# EAGLE design fabo-atmega-dev-au (EAGLE 7.7.0)
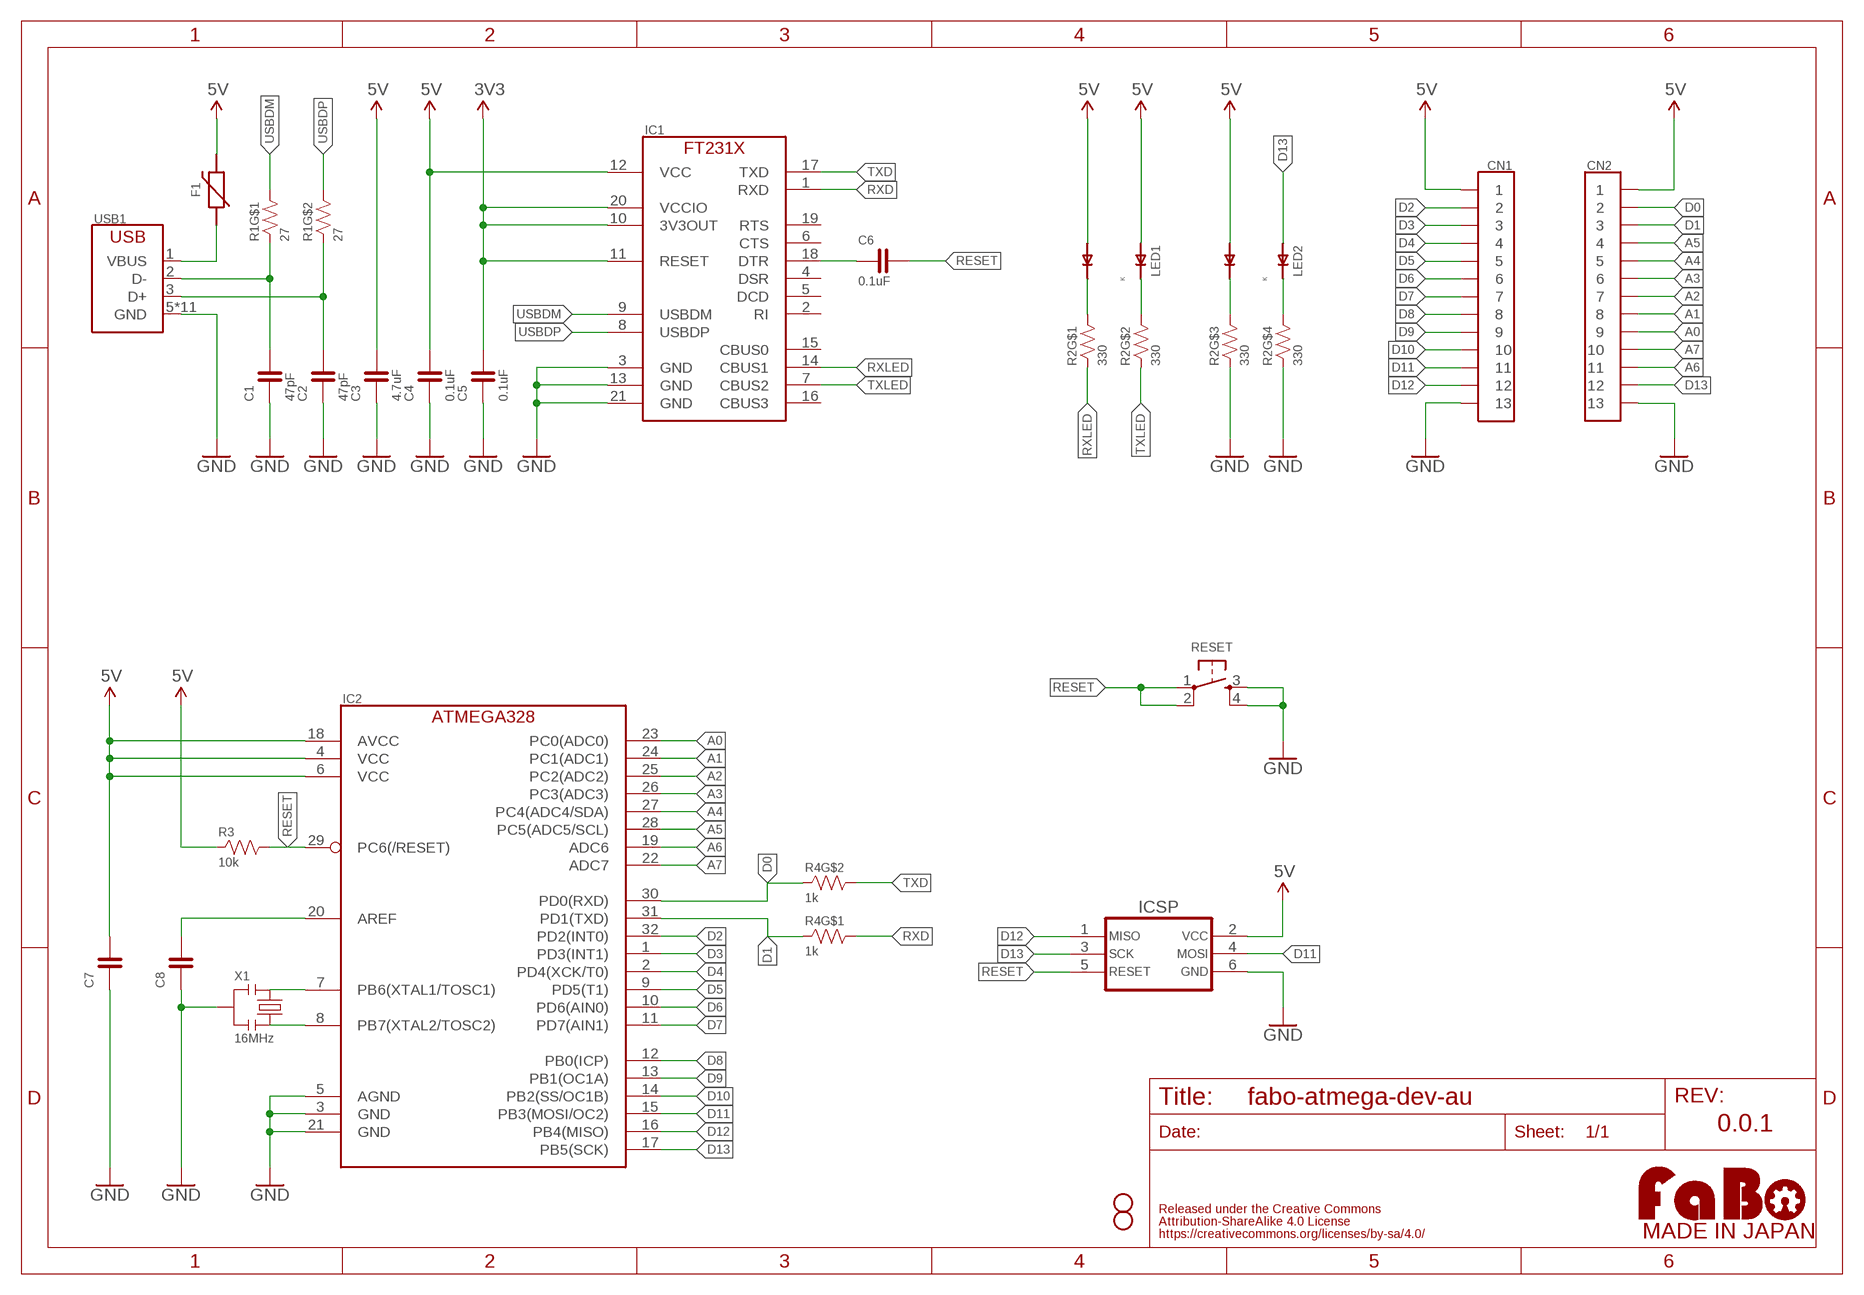
[diagram p0: schematic, sheet 1]

## Parts
C1  47pF  CAPACITOR-0603  [EIA0603]
C2  47pF  CAPACITOR-0603  [EIA0603]
C3  4.7uF  CAPACITOR-0603  [EIA0603]
C4  0.1uF  CAPACITOR-0603  [EIA0603]
C5  0.1uF  CAPACITOR-0603  [EIA0603]
C6  0.1uF  CAPACITOR-0603  [EIA0603]
C7  CAPACITOR-0603  [EIA0603]
C8  CAPACITOR-0603  [EIA0603]
CN1  PIN_1X13_NARROW  [PIN_1X13_NARROW]
CN2  PIN_1X13_NARROW  [PIN_1X13_NARROW]
F1  PPTC-NANO  [NANOSMDC035F]
FID1  FIDUCIAL-10  [FIDUCIAL_10]
FID2  FIDUCIAL-10  [FIDUCIAL_10]
IC1  FT231XQ  [QFN-20]
IC2  ATMEGA328P-AU  [TQFP-32]
ICSP  ICSP_AVR-TC_NOHOLE  [TC2030]
LED1  HSMF-C16X  [HSMF-C16X]
LED2  HSMF-C16X  [HSMF-C16X]
LOGO1  LOGO_FABO-M_BOTTOM  [LOGO_FABO_M_BOTTOM]
R1  27  RESISTOR_ARRAY_2  [EXBV4V]
R2  330  RESISTOR_ARRAY_4  [EXBV8V]
R3  10k  RESISTOR-0603  [EIA0603]
R4  1k  RESISTOR_ARRAY_2  [EXBV4V]
RESET  SWITCH-TACTILE-KMR2  [KMR2-TACT]
USB1  USB-ZX62D  [ZX62D-B-5PA8]
X1  16MHz  RESONATOR  [CSTNE_V_C]

## Nets
3V3: C5.2 IC1.10(3V3OUT) IC1.11(RESET) IC1.20(VCCIO)
5V: C3.2 C4.2 C7.2 CN1.1 CN2.1 F1.2 IC1.12(VCC) IC2.4(VCC) IC2.6(VCC) IC2.18(AVCC) ICSP.2 LED1.1(A1) LED1.2(A2) LED2.2(A2) R3.1
A0: CN2.9 IC2.23(PC0(ADC0))
A1: CN2.8 IC2.24(PC1(ADC1))
A2: CN2.7 IC2.25(PC2(ADC2))
A3: CN2.6 IC2.26(PC3(ADC3))
A4: CN2.5 IC2.27(PC4(ADC4/SDA))
A5: CN2.4 IC2.28(PC5(ADC5/SCL))
A6: CN2.11 IC2.19(ADC6)
A7: CN2.10 IC2.22(ADC7)
AREF: C8.2 IC2.20(AREF)
D0: CN2.2 IC2.30(PD0(RXD)) R4.2
D1: CN2.3 IC2.31(PD1(TXD)) R4.1
D2: CN1.2 IC2.32(PD2(INT0))
D3: CN1.3 IC2.1(PD3(INT1))
D4: CN1.4 IC2.2(PD4(XCK/T0))
D5: CN1.5 IC2.9(PD5(T1))
D6: CN1.6 IC2.10(PD6(AIN0))
D7: CN1.7 IC2.11(PD7(AIN1))
D8: CN1.8 IC2.12(PB0(ICP))
D9: CN1.9 IC2.13(PB1(OC1A))
D10: CN1.10 IC2.14(PB2(SS/OC1B))
D11: CN1.11 IC2.15(PB3(MOSI/OC2)) ICSP.4
D12: CN1.12 IC2.16(PB4(MISO)) ICSP.1
D13: CN2.12 IC2.17(PB5(SCK)) ICSP.3 LED2.1(A1)
D13LED_K: LED2.3(K1) R2.5
DTR: C6.1 IC1.18(DTR)
GND: C1.1 C2.1 C3.1 C4.1 C5.1 C7.1 C8.1 CN1.13 CN2.13 IC1.3(GND) IC1.13(GND) IC1.21(GND) IC2.3(GND) IC2.5(AGND) IC2.21(GND) ICSP.6 R2.3 R2.4 RESET.3 RESET.4 USB1.5(GND) USB1.B1(GND) USB1.B2(GND) USB1.B3(GND) USB1.B4(GND) USB1.T1(GND) USB1.T2(GND) USB1.T3(GND) USB1.T4(GND) USB1.T5(GND) USB1.T6(GND) X1.2
PB6: IC2.7(PB6(XTAL1/TOSC1)) X1.1
PB7: IC2.8(PB7(XTAL2/TOSC2)) X1.3
PWRLED_K: LED2.4(K2) R2.6
RESET: C6.2 IC2.29(PC6(/RESET)) ICSP.5 R3.2 RESET.1 RESET.2
RXD: IC1.1(RXD) R4.4
RXLED: IC1.14(CBUS1) R2.1
RXLED_K: LED1.4(K2) R2.8
TXD: IC1.17(TXD) R4.3
TXLED: IC1.7(CBUS2) R2.2
TXLED_K: LED1.3(K1) R2.7
USB_DM: C1.2 R1.1 USB1.2(D-)
USB_DP: C2.2 R1.2 USB1.3(D+)
USB_VBUS: F1.1 USB1.1(VBUS)
USBDM: IC1.9(USBDM) R1.4
USBDP: IC1.8(USBDP) R1.3
Unconnected: IC1.2(RI) IC1.4(DSR) IC1.5(DCD) IC1.6(CTS) IC1.15(CBUS0) IC1.16(CBUS3) IC1.19(RTS)

## Notes on the sheet
- 0.0.1

## Library data of the parts
C1-C8 = component:CAPACITOR
CN1 CN2 = component:PIN_1X13
F1 = component:PPTC
FID1 FID2 = component:FIDUCIAL
IC1 = component:FT231X
IC2 = component:ATMEGA328
ICSP = component:ICSP_AVR
LED1 LED2 = component:HSMF-C16X
LOGO1 = component:LOGO_FABO
R1 R4 = component:RESISTOR_ARRAY_2
R2 = component:RESISTOR_ARRAY_4
R3 = component:RESISTOR
RESET = component:SWITCH-TACTILE
USB1 = component:USB
X1 = component:RESONATOR

## Board
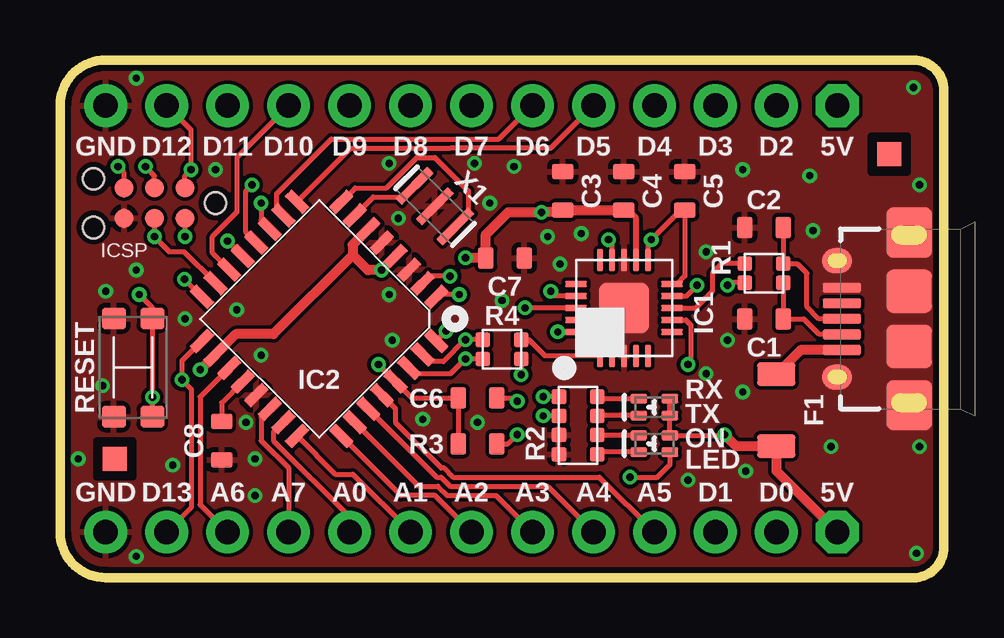
[diagram p1: board, top side]
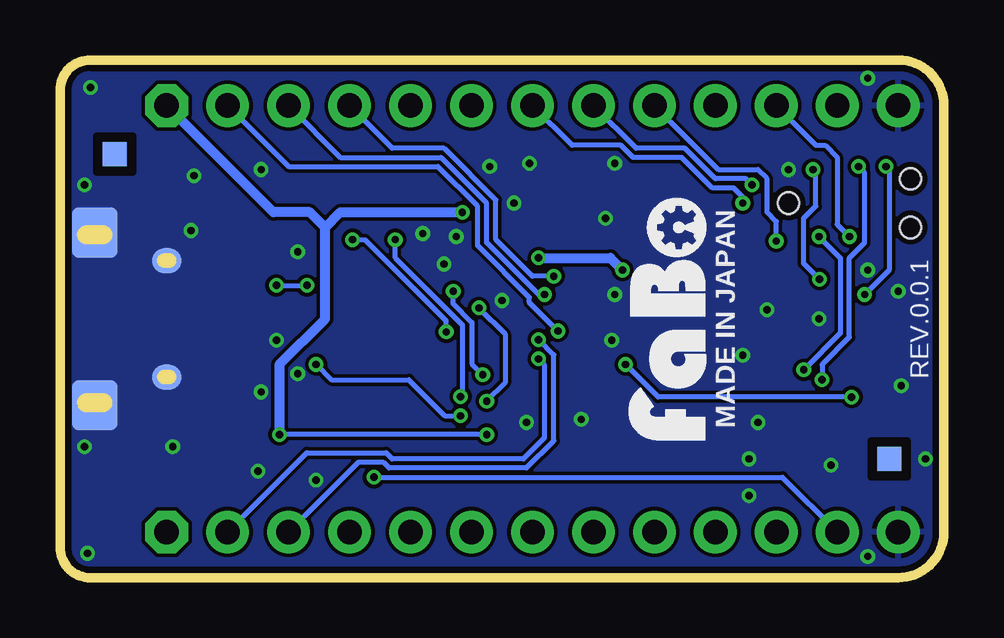
[diagram p2: board, bottom side, seen from below]

Size 36.83 x 21.59 mm. Coordinates in mm from the lower left corner, seen from the top.
Outline: 1.91,0 35.56,0 arc90 36.83,1.27 36.83,20.32 arc90 35.56,21.59 1.91,21.59 arc90 0,19.68 0,1.91 arc90 1.91,0
Copper layers (1*16): Top 0.035mm / dielectric 1.6mm / Bottom 0.035mm
Design rules "PCBway": minimum track width 6mil, minimum drill 12mil, track to track 6mil, track to pad 6mil, pad to pad 6mil, via to via 6mil, smd to smd 6mil, copper to edge 10mil, drill to drill 10mil, minimum pad ring 10mil, minimum via ring 6mil, stop-mask expansion 2mil, vias tented up to drill 100mil, thermal gap 8mil

### Footprints (pad centres in the part's own frame; a part is rotated, then mirrored left to right if it is on the bottom)
EIA0603 = smd 0.65 x 0.9: 1 -0.8,0; 2 0.8,0
PIN_1X13_NARROW = drill 1.02 pad 1.778 octagon: 1 -15.24,0 | drill 1.02 pad 1.778: 2 -12.7,0; 3 -10.16,0; 4 -7.62,0; 5 -5.08,0; 6 -2.54,0; 7 0,0; 8 2.54,0; 9 5.08,0; 10 7.62,0; 11 10.16,0; 12 12.7,0; 13 15.24,0
NANOSMDC035F = smd 1 x 1.6: 1 -1.5,0; 2 1.5,0
FIDUCIAL_10 = smd 1 x 1: F1 0,0 | smd 1 x 1 bottom: F2 0,0
QFN-20 = smd 0.9 x 0.25: 1 -2,1; 2 -2,0.5; 3 -2,0; 4 -2,-0.5; 5 -2,-1; 11 2,-1; 12 2,-0.5; 13 2,0; 14 2,0.5; 15 2,1 | smd 0.25 x 0.9: 6 -1,-2; 7 -0.5,-2; 8 0,-2; 9 0.5,-2; 10 1,-2; 16 1,2; 17 0.5,2; 18 0,2; 19 -0.5,2; 20 -1,2 | smd 2.1 x 2.1: 21 0,0
TQFP-32 = smd 1.1 x 0.45: 1 -4.1,2.8; 2 -4.1,2; 3 -4.1,1.2; 4 -4.1,0.4; 5 -4.1,-0.4; 6 -4.1,-1.2; 7 -4.1,-2; 8 -4.1,-2.8; 17 4.1,-2.8; 18 4.1,-2; 19 4.1,-1.2; 20 4.1,-0.4; 21 4.1,0.4; 22 4.1,1.2; 23 4.1,2; 24 4.1,2.8 | smd 0.45 x 1.1: 9 -2.8,-4.1; 10 -2,-4.1; 11 -1.2,-4.1; 12 -0.4,-4.1; 13 0.4,-4.1; 14 1.2,-4.1; 15 2,-4.1; 16 2.8,-4.1; 25 2.8,4.1; 26 2,4.1; 27 1.2,4.1; 28 0.4,4.1; 29 -0.4,4.1; 30 -1.2,4.1; 31 -2,4.1; 32 -2.8,4.1
TC2030 = smd 0.787 x 0.787: 1 1.27,-0.635; 2 1.27,0.635; 3 2.54,-0.635; 4 2.54,0.635; 5 3.81,-0.635; 6 3.81,0.635 | hole 0.889: 0,0; 5.08,-1.016; 5.08,1.016
HSMF-C16X = smd 0.7 x 0.4: 1 -0.65,0.35; 2 -0.65,-0.35; 3 0.65,0.35; 4 0.65,-0.35
EXBV4V = smd 0.6 x 0.6: 1 -0.4,-0.8; 2 0.4,-0.8; 3 0.4,0.8; 4 -0.4,0.8
EXBV8V = smd 0.6 x 0.6: 1 -1.2,-0.8; 2 -0.4,-0.8; 3 0.4,-0.8; 4 1.2,-0.8; 5 1.2,0.8; 6 0.4,0.8; 7 -0.4,0.8; 8 -1.2,0.8
KMR2-TACT = smd 0.9 x 1: 1 -2.05,0.8; 2 2.05,0.8; 3 2.05,-0.8; 4 -2.05,-0.8
ZX62D-B-5PA8 = smd 0.4 x 1.6: 1 -1.3,4.25; 2 -0.65,4.25; 3 0,4.25; 4 0.65,4.25; 5 1.3,4.25 | smd 1.05 x 1.25 bottom: B1 -2.425,4.45; B2 2.425,4.45 | smd 2.1 x 1.9 bottom: B3 -3.6,1.45; B4 3.6,1.45 | smd 1.05 x 1.25: T1 -2.425,4.45; T2 2.425,4.45 | smd 2.1 x 1.9: T3 -3.6,1.45; T6 3.6,1.45 | smd 1.8 x 1.9: T4 -1.15,1.45; T5 1.15,1.45
CSTNE_V_C = smd 0.4 x 1.9: 1 1.2,0; 2 0,0; 3 -1.2,0

### Placement (x,y rotation side)
C1  29.34,10.79 0 top
C2  29.34,14.61 0 top
C3  20.95,16.13 270 top
C4  23.5,16.13 270 top
C5  26.04,16.13 270 top
C6  17.4,7.49 180 top
C7  18.54,13.34 180 top
C8  6.73,5.71 90 top
CN1  17.14,19.68 180 top
CN2  17.14,1.91 180 top
F1  29.84,6.99 270 top
FID1  2.29,4.95 0 top
FID2  34.54,17.65 0 top
IC1  23.5,11.25 90 top
IC2  10.79,10.79 225 top
ICSP  6.48,15.62 180 top
LED1  24.77,7.11 180 top
LED2  24.77,5.59 180 top
LOGO1  9.53,10.79 270 top
R1  29.34,12.7 90 top
R2  21.59,6.35 270 top
R3  17.4,5.59 180 top
R4  18.41,9.53 270 top
RESET  3.05,8.76 270 top
USB1  36.83,10.79 90 top
X1  15.62,15.49 135 top

### Tracks (layer width: path | path; a pad name or v marks a point on that pad's centre or on a via)
3V3  (via drill 0.3)
  Top 0.203: IC1.20 v20.74,10.25 | IC1.11 24.5,13.96 v24.64,14.1 25.87,15.33 C5.2 26.04,12.57 25.71,12.25 IC1.10
  Bottom 0.203: v24.64,14.1 24.13,14.1 20.74,10.71 v20.74,10.25
5V  (via drill 0.3)
  Top 0.203: LED1.2 LED1.1 LED2.2 27.66,5.94 v27.69,5.97 | ICSP.2 v5.21,14.22 | 24,14.98 24,14.99 | C4.2 23.66,15.33 | R3.1 18.67,5.59 v19.05,5.97
  Top 0.254: IC1.12 24,14.98 | 23.66,15.33 24,14.99
  Top 0.406: IC2.6 12.19,13.89 12.19,13.46 | IC2.4 v13.39,12.83 12.83,12.83 12.19,13.46 | v16.89,13.34 C7.2 17.74,14.31 18.67,15.24 v20.07,15.24 20.87,15.24 C3.2 C4.2 | v5.84,8.67 IC2.18 7.33,10.16 8.89,10.16 12.19,13.46 | CN2.1 29.84,4.45 F1.2 28.17,5.49 v27.69,5.97
  Bottom 0.203: v5.84,8.67 4.32,10.19 4.32,13.34 v5.21,14.22 | v19.05,5.97 v27.69,5.97
  Bottom 0.406: v16.89,13.34 13.9,13.34 v13.39,12.83 | 25.78,14.61 25.78,10.79 27.69,8.89 v27.69,5.97 | 25.78,14.61 25.15,15.24 v20.07,15.24 | 25.78,14.61 26.42,15.24 27.94,15.24 CN1.1
A0
  Top 0.203: IC2.23 8.89,6.06 8.89,5.71 12.06,2.54 CN2.9
A1
  Top 0.203: IC2.24 11.47,4.32 12.19,4.32 CN2.8
A2
  Top 0.203: IC2.25 14.2,3.43 15.62,3.43 CN2.7
A3
  Top 0.203: IC2.26 14.95,3.81 15.75,3.81 16.13,3.43 18.16,3.43 CN2.6
A4
  Top 0.203: IC2.27 15.7,4.19 15.88,4.19 16.26,3.81 20.32,3.81 CN2.5
A5
  Top 0.203: CN2.4 22.48,4.19 16.38,4.19 16,4.57 15.88,4.57 13.97,6.48 13.97,7.05 IC2.28
A6
  Top 0.203: IC2.19 5.84,7.54 5.84,3.05 CN2.11
A7
  Top 0.203: IC2.22 8.38,6.68 8.38,5.71 9.53,4.57 CN2.10
AREF
  Top 0.203: IC2.20 6.73,7.3 C8.2
D0  (via drill 0.3)
  Top 0.203: R4.2 v16.89,9.12 16.27,8.51 14.78,8.51 IC2.30
  Bottom 0.203: v16.89,9.12 16.64,8.87 16.64,5.84 17.53,4.95 22.99,4.95 23.24,5.21 26.54,5.21 CN2.2
D1  (via drill 0.3)
  Top 0.203: R4.1 v16.89,9.93 15.98,9.02 15.4,9.02 IC2.31
  Bottom 0.203: CN2.3 24.38,4.83 23.37,4.83 23.11,4.57 17.4,4.57 16.26,5.71 16.26,9.29 v16.89,9.93
D2  (via drill 0.3)
  Top 0.203: IC2.32 v16.09,10.29
  Bottom 0.203: CN1.2 27.3,17.14 21.08,17.14 19.43,15.49 19.43,13.84 17.27,11.68 17.27,11.47 v16.09,10.29
D3  (via drill 0.3)
  Top 0.203: v16.64,11.81 15.77,11.81 IC2.1
  Bottom 0.203: CN1.3 25.15,17.53 20.95,17.53 19.05,15.62 19.05,13.97 16.89,11.81 v16.64,11.81
D4  (via drill 0.3)
  Top 0.203: v16.26,12.57 15.4,12.57 IC2.2
  Bottom 0.203: v16.26,12.57 17.14,12.57 18.67,14.1 18.67,15.75 20.83,17.91 22.99,17.91 CN1.4
D5
  Top 0.203: IC2.9 12.11,17.91 15.75,17.91 16.26,17.91 20.45,17.91 CN1.5
D6
  Top 0.203: CN1.6 18.29,18.29 11.3,18.29 9.02,16 9.02,15.4 IC2.10
D7  (via drill 0.3)
  Top 0.203: v8.38,15.62 8.38,14.9 IC2.11
  Bottom 0.203: v8.38,15.62 8.38,15.88 8.76,16.26 9.65,16.26 10.92,17.53 12.95,17.53 13.46,18.03 15.49,18.03 CN1.7
D8  (via drill 0.3)
  Top 0.203: IC2.12 7.75,14.41 7.75,16.13 v8,16.38
  Bottom 0.203: v8,16.38 8.26,16.64 9.53,16.64 10.79,17.91 12.83,17.91 CN1.8
D9  (via drill 0.3)
  Top 0.203: IC2.13 v6.99,14.04
  Bottom 0.203: v6.99,14.04 6.99,14.86 7.37,15.24 7.37,16.64 7.75,17.02 9.4,17.02 CN1.9
D10
  Top 0.203: IC2.14 6.35,13.54 6.35,14.22 7.37,15.24 7.37,17.53 CN1.10
D11  (via drill 0.3)
  Top 0.203: IC2.15 5.17,13.59 4.57,13.59 v3.94,14.22 ICSP.4
  Bottom 0.203: CN1.11 5.33,18.03 4.95,18.03 4.45,17.53 4.45,14.73 v3.94,14.22
D12  (via drill 0.3)
  Top 0.203: IC2.16 v5.18,12.45 | CN1.12 5.46,18.67 v5.46,17.02 5.21,16.76 ICSP.1
  Bottom 0.203: v5.18,12.45 5.84,13.1 5.84,14.99 5.33,15.49 5.33,16.89 v5.46,17.02
D13  (via drill 0.3)
  Top 0.203: v23.75,4.19 24.89,4.19 25.41,4.71 LED2.1 | ICSP.3 3.94,16.76 v3.56,17.14 | CN2.12 5.46,2.92 5.46,7.87 v5.08,8.26 5.08,9.04 IC2.17
  Bottom 0.203: v23.75,4.19 6.73,4.19 CN2.12 | v3.56,17.14 3.3,16.89 3.3,13.97 3.94,13.34 3.94,10.03 5.08,8.89 v5.08,8.26
D13LED_K
  Top 0.203: LED2.3 22.48,5.24 R2.5
DTR  (via drill 0.3)
  Top 0.203: IC1.18 v19.38,11.25 | C6.1 18.92,7.49 v19.05,7.37
  Bottom 0.203: v19.38,11.25 18.29,10.16 18.29,8.13 v19.05,7.37
GND  (via drill 0.3)
  other vias: 26.92,13.59 3.17,20.83 7.75,6.48 13.72,17.27 13.72,11.81 13.84,9.91 7.37,11.18 5.21,10.79 8.38,9.27 14.1,14.99 17.27,17.27 17.91,15.62 20.32,14.22 21.72,14.35 20.83,13.08 18.92,17.14 35.56,20.45 35.69,1.02 35.81,5.46 35.81,16.38 3.17,0.89 0.76,4.95 1.91,11.94 1.78,8 8.13,4.95 8.13,3.43 4.7,4.7 15.11,6.6 17.4,6.48 28.57,4.45 28.45,7.75 32.13,5.46 31.37,14.48 31.24,16.76 28.45,17.02 6.48,17.02 3.17,12.83 18.41,11.56 27.81,9.91 26.92,8.51 26.16,4.06
  pour Bottom (isolate 0.152, rank 3): 0,0 36.83,0 36.83,21.59 0,21.59
  pour Top (isolate 0.152, rank 3): 0,0 36.83,0 36.83,21.59 0,21.59
  pour Top (isolate 0.152, rank 3, no thermals): 21.5,13.25 25.5,13.25 25.5,9.25 21.5,9.25
  pour Top (isolate 0.152, rank 2, no thermals): 36.83,16 31.24,16 31.24,5.59 36.83,5.59
  pour Bottom (isolate 0.152, rank 2, no thermals): 36.83,16 31.24,16 31.24,5.59 36.83,5.59
PB6
  Top 0.203: IC2.7 13.05,15.88 14.3,15.88 X1.1
PB7
  Top 0.203: IC2.8 12.3,16.26 13.59,16.26 14.86,17.53 15.62,17.53 17.02,16.13 17.02,15.19 X1.3
PWRLED_K
  Top 0.203: LED2.4 22.4,5.94 R2.6
RESET  (via drill 0.3)
  Top 0.203: R3.2 C6.2 14.66,7.49 IC2.29 v13.27,8.89 | ICSP.5 2.67,16.89 v2.41,17.14 | v3.85,7.53 RESET.2 RESET.1 3.85,11.27 v3.3,11.81
  Bottom 0.203: v2.41,17.14 2.29,17.02 2.29,12.83 v3.3,11.81 | v3.85,7.53 11.91,7.53 v13.27,8.89
RXD
  Top 0.203: IC1.1 20.21,9.25 19.54,9.93 R4.4
RXLED  (via drill 0.3)
  Top 0.203: IC1.14 23,13.96 v22.86,14.1 | R2.1 v20.14,7.55
  Bottom 0.203: v22.86,14.1 22.86,13.34 20.07,10.54 20.07,7.62 v20.14,7.55
RXLED_K
  Top 0.203: LED1.4 22.48,7.46 R2.8
TXD  (via drill 0.3)
  Top 0.203: IC1.17 20.64,11.75 v20.45,11.94 | R4.3 v19.21,8.47
  Bottom 0.203: v19.21,8.47 19.67,8.92 19.67,10.65 20.45,11.43 v20.45,11.94
TXLED  (via drill 0.3)
  Top 0.203: IC1.7 26.08,10.75 26.29,10.54 26.29,9.02 v26.16,8.89 | R2.2 v20.14,6.75
  Bottom 0.203: v26.16,8.89 25.53,8.26 22.3,8.26 R2.2 v20.14,6.75
TXLED_K
  Top 0.203: LED1.3 22.4,6.76 R2.7
USB_DM
  Top 0.203: R1.1 C1.2 30.99,10.79 31.64,10.14 USB1.2
USB_DP
  Top 0.203: USB1.3 31.62,10.79 31.11,11.3 31.11,12.7 30.71,13.1 R1.2 C2.2
USB_VBUS
  Top 0.406: USB1.1 30.86,9.49 F1.1
USBDM  (via drill 0.3)
  Top 0.203: 26.28,11.93 v26.54,12.19 26.1,11.75 IC1.9 | R1.4 27.92,12.3 v27.81,12.19
  Bottom 0.203: v27.81,12.19 v26.54,12.19
USBDP
  Top 0.203: R1.3 27.58,13.1 27.18,12.7 27.18,11.94 26.49,11.25 IC1.8

### Text on the board
tPlace: GND | D12 | D11 | D10 | D9 | D8 | D7 | D6 | D5 | D4 | D3 | D2 | 5V | RX | TX | ON | LED | GND | D13 | A6 | A7 | A0 | A1 | A2 | A3 | A4 | A5 | D1 | D0 | 5V
bPlace: REV.0.0.1 | MADE IN JAPAN